# EAGLE design shield 3 (EAGLE 5.06)
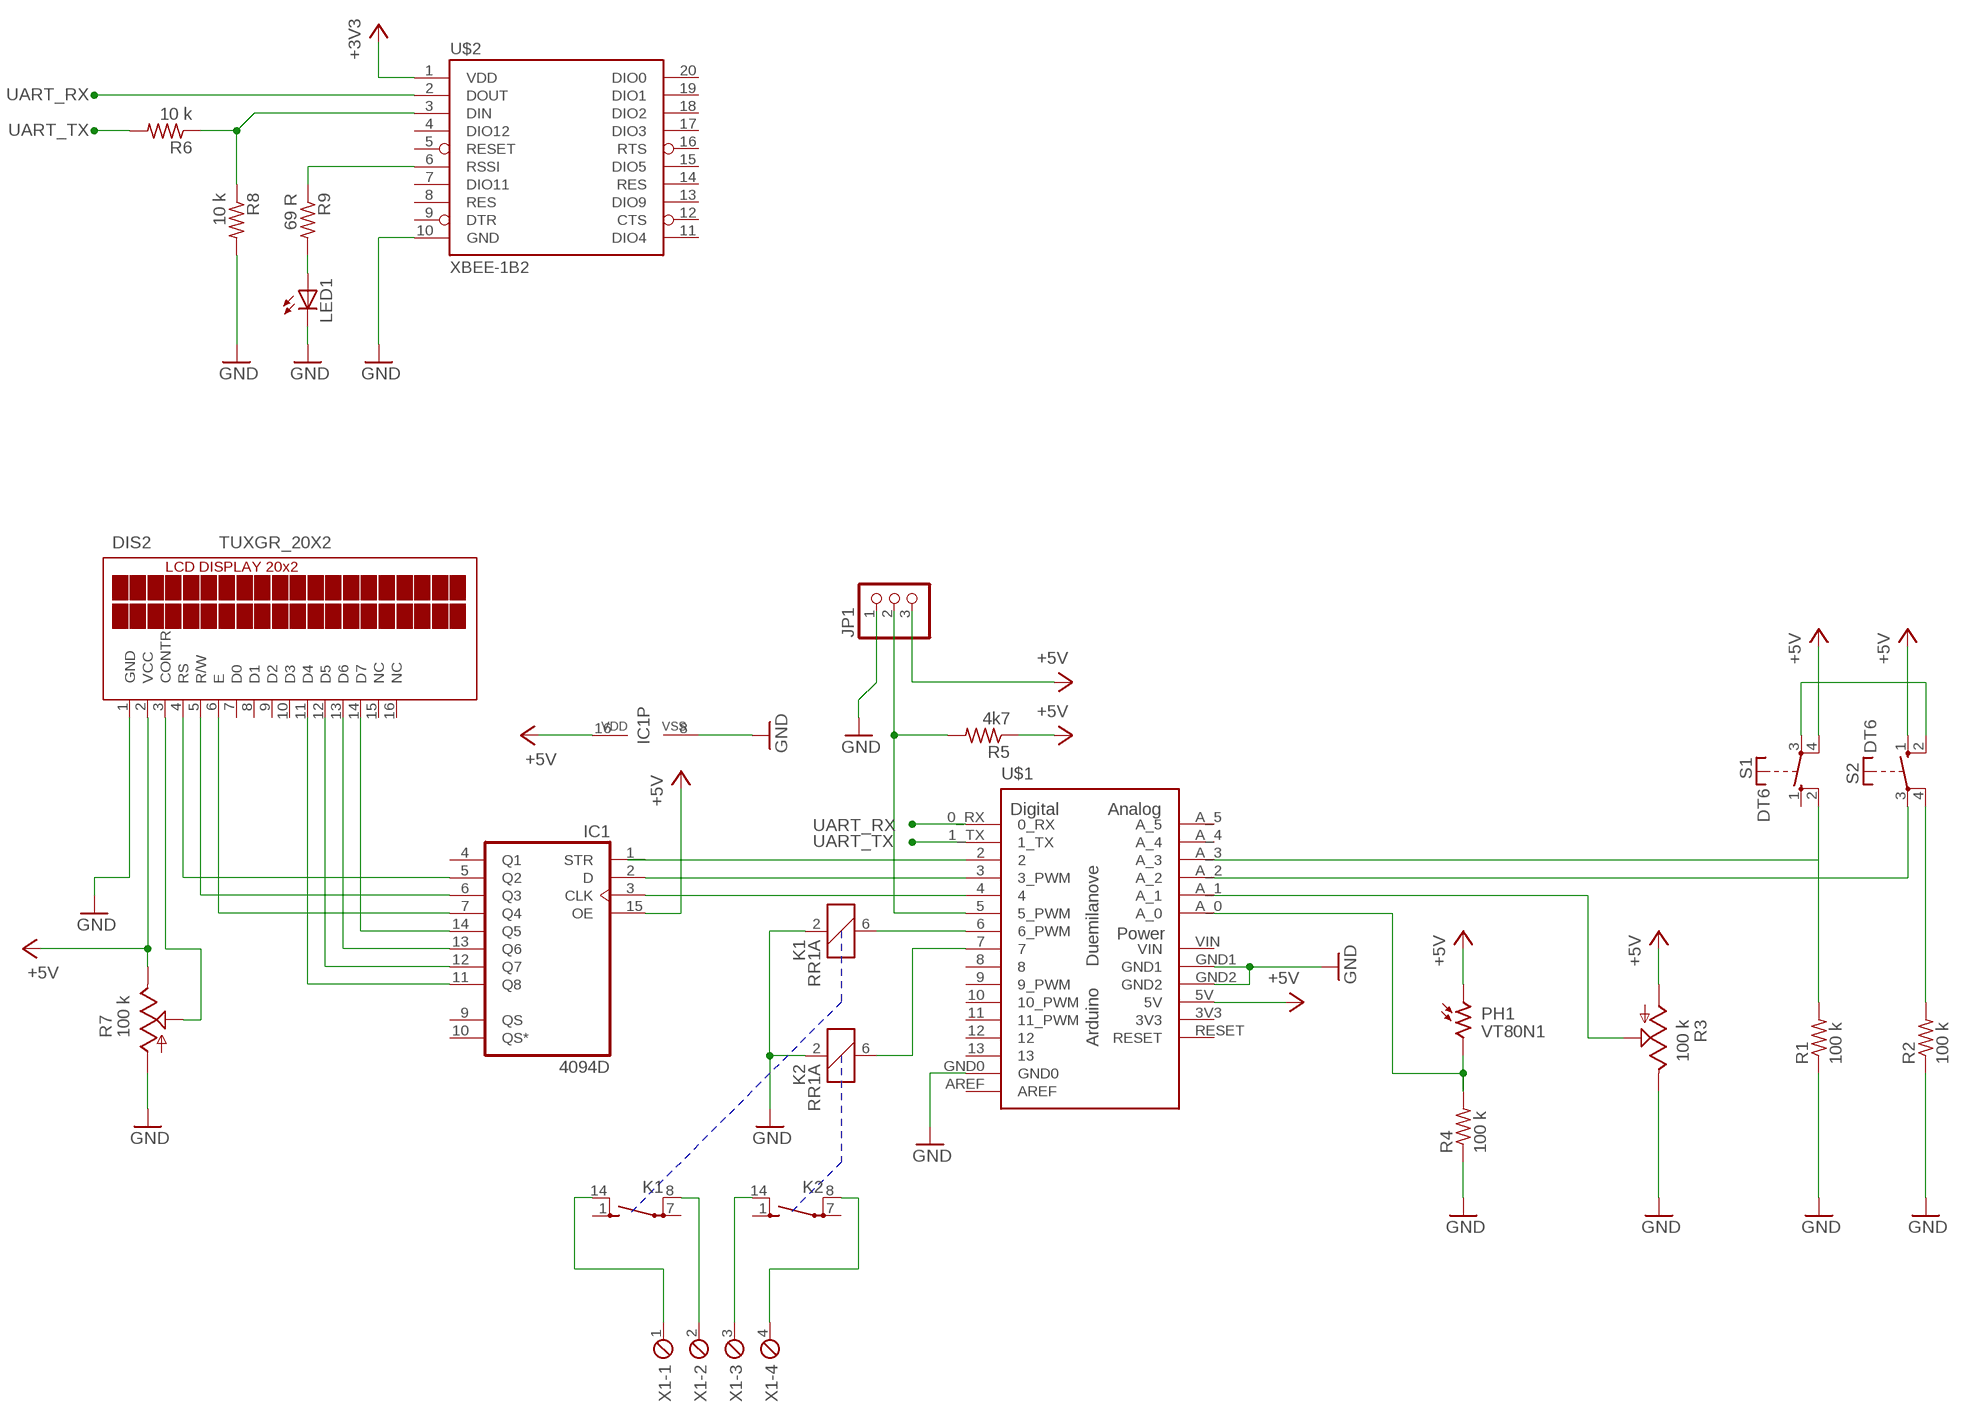
[diagram p0: schematic, sheet 1]

## Parts
DIS2  TUXGR_20X2  [TUXGR_20X2]
IC1  4094D  [SO16]
JP1  PINHD-1X3  [1X03]
K1  RR1A  [RR1A]
K2  RR1A  [RR1A]
LED1  LED3MM  [LED3MM]
PH1  VT80N1  [VT800]
R1  100 k  R-US_R0805  [R0805]
R2  100 k  R-US_R0805  [R0805]
R3  100 k  TRIM_US-B25V  [B25V]
R4  100 k  R-US_R0805  [R0805]
R5  4k7  R-US_R0805  [R0805]
R6  10 k  R-US_R0805  [R0805]
R7  100 k  TRIM_US-S64W  [S64W]
R8  10 k  R-US_R0805  [R0805]
R9  69 R  R-US_R0805  [R0805]
S1  DT6  [DT6]
S2  DT6  [DT6]
U$1  ARDUINO-USBLONG_PADS_TEXT  [SHIELD]
U$2  XBEE-1B2  [XBEE-SILK]
X1  MPT4  [4POL254]

## Nets
+3V3: U$2.1(VDD)
+5V: DIS2.2(VCC) IC1.15(OE) IC1.16(VDD) JP1.3 PH1.1 R3.A R5.1 R7.E S1.4(P) S2.1(S) U$1.5V
GND: DIS2.1(GND) IC1.8(VSS) JP1.1 K1.2 K2.2 LED1.K(C) R1.1 R2.1 R3.E R4.1 R7.A R8.2 U$1.GND0 U$1.GND1 U$1.GND2 U$2.10(GND)
N$1: IC1.1(STR) U$1.2
N$2: IC1.3(CLK) U$1.4
N$3: IC1.2(D) U$1.3(3_PWM)
N$4: K1.6 U$1.6(6_PWM)
N$5: K2.6 U$1.7
N$6: K1.14(2:S) X1.1
N$7: K1.8(2:P) X1.2
N$9: K2.8(2:P) X1.4
N$10: R1.2 S1.2(S) U$1.A_3
N$11: R3.S U$1.A_1
N$12: S2.3(P) U$1.A_2
N$13: PH1.2 R4.2 U$1.A_0
N$14: DIS2.11(D4) IC1.11(Q8)
N$15: DIS2.12(D5) IC1.12(Q7)
N$16: DIS2.13(D6) IC1.13(Q6)
N$17: DIS2.14(D7) IC1.14(Q5)
N$18: DIS2.4(RS) IC1.5(Q2)
N$19: DIS2.5(R/W) IC1.6(Q3)
N$20: DIS2.6(E) IC1.7(Q4)
N$21: DIS2.3(CONTR) R7.S
N$22: JP1.2 R5.2 U$1.5(5_PWM)
N$23: R9.1 U$2.6(RSSI)
N$24: LED1.A R9.2
N$25: R2.2 S2.4(P)
N$26: R6.1 R8.1 U$2.3(DIN)
N$27: S1.3(P) S2.2(S)
N$30: K2.14(2:S) X1.3
UART_RX: U$1.0_RX U$2.2(DOUT)
UART_TX: R6.2 U$1.1_TX
Unconnected: DIS2.7(D0) DIS2.8(D1) DIS2.9(D2) DIS2.10(D3) DIS2.15(NC) DIS2.16(NC) IC1.4(Q1) IC1.9(QS) IC1.10(QS*) K1.1(2:S) K1.7(2:P) K2.1(2:S) K2.7(2:P) S1.1(S) U$1.8 U$1.9(9_PWM) U$1.10(10_PWM) U$1.11(11_PWM) U$1.12 U$1.13 U$1.A_4 U$1.A_5 U$1.AREF U$1.RESET U$2.4(DIO12) U$2.5(RESET) U$2.7(DIO11) U$2.8(RES) U$2.9(DTR) U$2.11(DIO4) U$2.12(CTS) U$2.13(DIO9) U$2.14(RES) U$2.15(DIO5) U$2.16(RTS) U$2.17(DIO3) U$2.18(DIO2) U$2.19(DIO1) U$2.20(DIO0)

## Buses
B$1
B$2

## Power pins joined to a net without a drawn wire
3V3: U$1.3V3
VIN: U$1.VIN

## Library data of the parts
DIS2 = display-lcd:TUXGR_20X2: Tuxgraphics LCD display 20x2 characters reflective, without background light Source: tuxgr_20x2.pdf
IC1 = 40xx:4094: 8-stage SHIFT/STORE REGISTER, tri-state
JP1 = pinhead:PINHD-1X3: PIN HEADER
K1 K2 = relay:RR1A: RELAY reed, polarity, 1 x norm. open with shield
LED1 = led:LED: LED OSRAM: - CHIPLED LG R971, LG N971, LY N971, LG Q971, LY Q971, LO R971, LY R971 LH N974, LH R974 LS Q976, LO Q976, LY Q976 LO Q996 - Hyper CHIPLED LW Q18S LB Q993, LB Q99A, LB R99A - SideLED LS A670, LO A670, LY A670, LG A670, LP A670 LB A673, LV A673, LT A673, LW A673 LH A674 LY A675 LS A676, LA A676, LO A676, LY A676, LW A676 LS A679, LY A679, LG A679 - Hyper Micro SIDELED® LS Y876, LA Y876, LO Y876, LY Y876 LT Y87S - SmartLED LW L88C, LW L88S LB L89C, LB L89S, LG L890 LS L89K, LO L89K, LY L89K LS L896, LA L896, LO L896, LY L896 - TOPLED LS T670, LO T670, LY T670, LG T670, LP T670 LSG T670, LSP T670, LSY T670, LOP T670, LYG T670 LG T671, LOG T671, LSG T671 LB T673, LV T673, LT T673, LW T673 LH T674 LS T676, LA T676, LO T676, LY T676, LB T676, LH T676, LSB T676, LW T676 LB T67C, LV T67C, LT T67C, LS T67K, LO T67K, LY T67K, LW E67C LS E67B, LA E67B, LO E67B, LY E67B, LB E67C, LV E67C, LT E67C LW T67C LS T679, LY T679, LG T679 LS T770, LO T770, LY T770, LG T770, LP T770 LB T773, LV T773, LT T773, LW T773 LH T774 LS E675, LA E675, LY E675, LS T675 LS T776, LA T776, LO T776, LY T776, LB T776 LHGB T686 LT T68C, LB T68C - Hyper Mini TOPLED® LB M676 - Mini TOPLED Santana® LG M470 LS M47K, LO M47K, LY M47K Source: http://www.osram.convergy.de LUXEON: - LUMILED® LXK2-PW12-R00, LXK2-PW12-S00, LXK2-PW14-U00, LXK2-PW14-V00 LXK2-PM12-R00, LXK2-PM12-S00, LXK2-PM14-U00 LXK2-PE12-Q00, LXK2-PE12-R00, LXK2-PE12-S00, LXK2-PE14-T00, LXK2-PE14-U00 LXK2-PB12-K00, LXK2-PB12-L00, LXK2-PB12-M00, LXK2-PB14-N00, LXK2-PB14-P00, LXK2-PB14-Q00 LXK2-PR12-L00, LXK2-PR12-M00, LXK2-PR14-Q00, LXK2-PR14-R00 LXK2-PD12-Q00, LXK2-PD12-R00, LXK2-PD12-S00 LXK2-PH12-R00, LXK2-PH12-S00 LXK2-PL12-P00, LXK2-PL12-Q00, LXK2-PL12-R00 Source: www.luxeon.com KINGBRIGHT: KA-3528ASYC Source: www.kingbright.com
PH1 = photo-elements:VT8: Photoconductive Cell VT800 Series Source: http://optoelectronics.perkinelmer.com/content/Datasheets/DTS_vt800seriesdatasheet.pdf
R1 R2 R4-R6 R8 R9 = rcl:R-US_: RESISTOR, American symbol
R3 R7 = pot:TRIM_US-: POTENTIOMETER
S1 S2 = switch-misc:DT: ITT SWITCH
U$1 = Arduino-Various:ARDUINO-USB: The Ardiuno Duemilanove Pinouts layoutet as a Bare Shield. v0.5 Also for Arduino Diecimila. This is designed as a Part and has no Outline in the Dimension Layer. The Outline, when present, is drawed at the tPlace / bPlace Layer. Library by Stephanie Lange, http://www.k-ita.de/~sl/
U$2 = SparkFun:XBEE-1
X1 = con-phoenix-254:MPT4: PHOENIX CONNECTOR

## Board
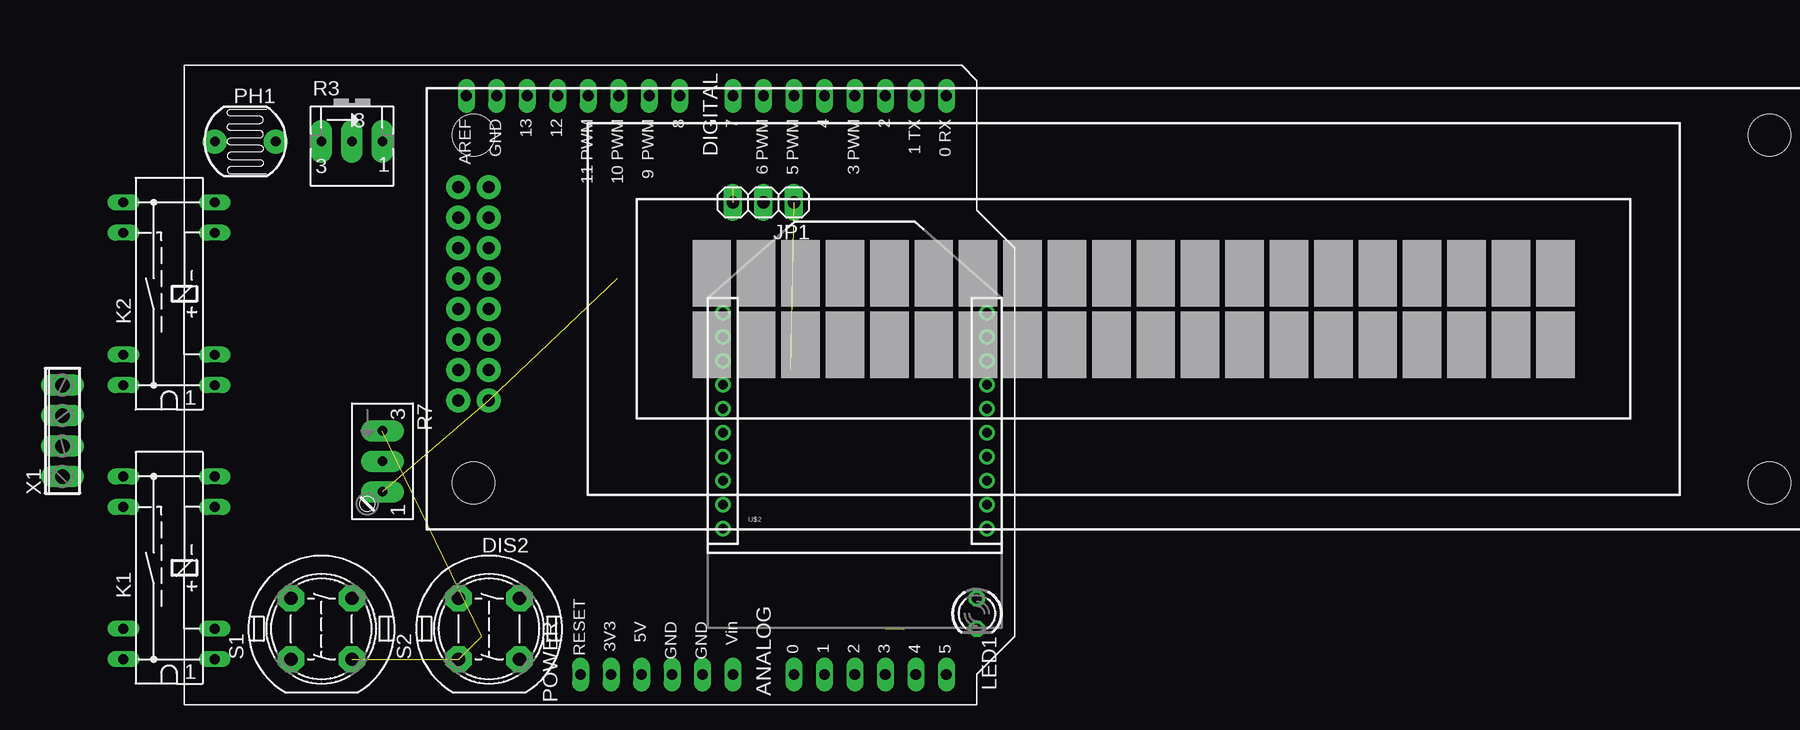
[diagram p1: board, top side]
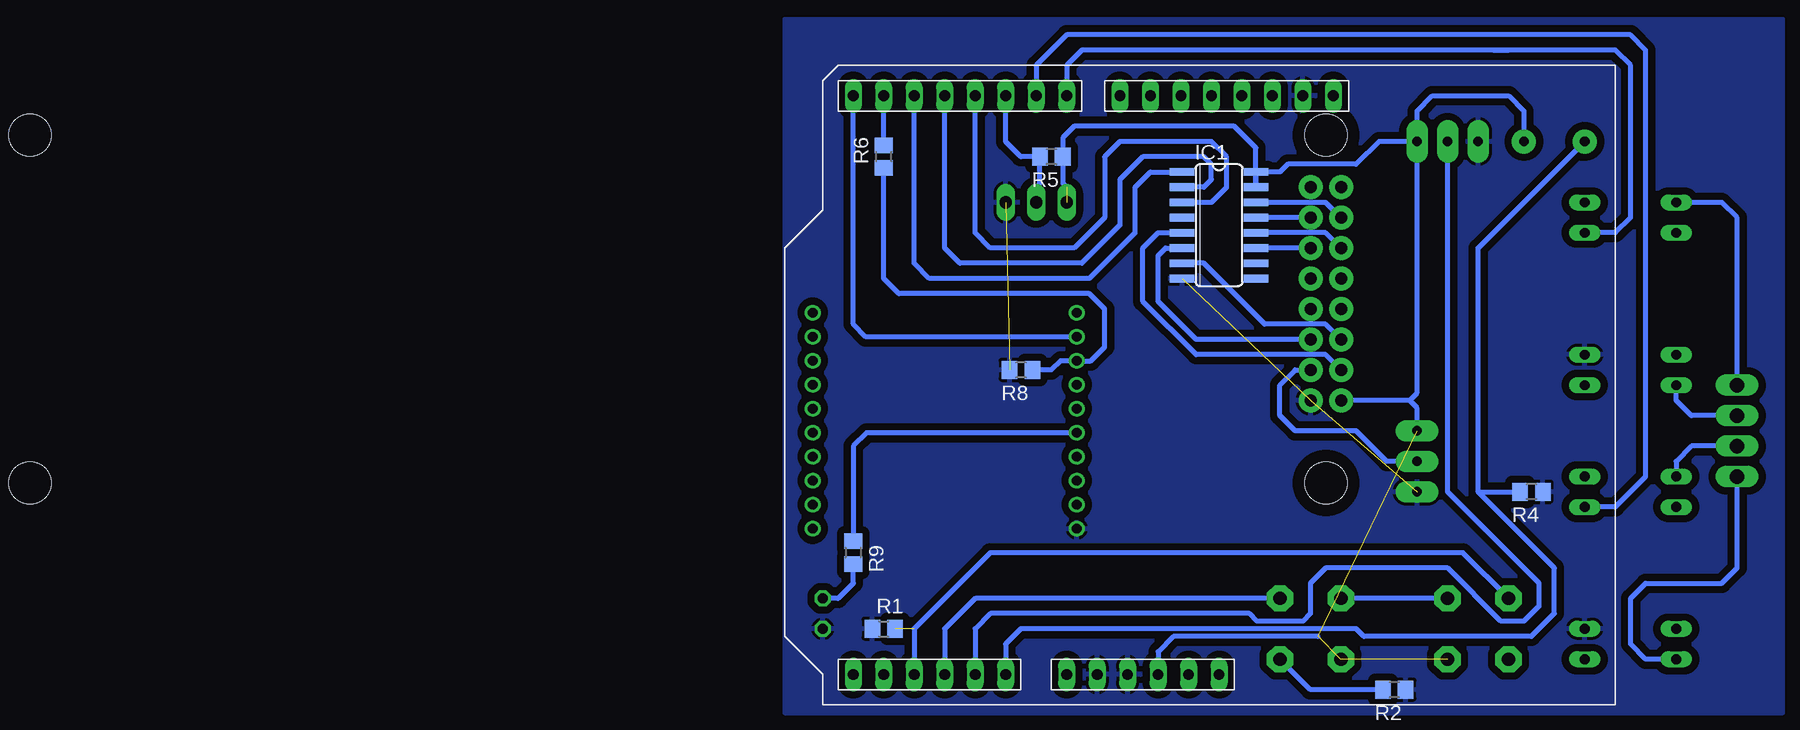
[diagram p2: board, bottom side, seen from below]

No outline drawn. Coordinates in mm, seen from the top.
Copper layers (1*16): Top 0.035mm / dielectric 1.5mm / Bottom 0.035mm
Design rules "default": minimum track width 10mil, minimum drill 24mil, track to track 8mil, track to pad 8mil, pad to pad 8mil, via to via 8mil, smd to smd 8mil, copper to edge 40mil, drill to drill 8mil, minimum pad ring 10mil, minimum via ring 8mil, stop-mask expansion 4mil, vias tented up to drill 0mil, thermal gap 10mil

### Footprints (pad centres in the part's own frame; a part is rotated, then mirrored left to right if it is on the bottom)
TUXGR_20X2 = drill 1 pad 2 round: 1 -52.73,-7.62; 2 -55.27,-7.62; 3 -52.73,-5.08; 4 -55.27,-5.08; 5 -52.73,-2.54; 6 -55.27,-2.54; 7 -52.73,0; 8 -55.27,0; 9 -52.73,2.54; 10 -55.27,2.54; 11 -52.73,5.08; 12 -55.27,5.08; 13 -52.73,7.62; 14 -55.27,7.62; 15 -52.73,10.16; 16 -55.27,10.16 | hole 3.5: -54,-14.5; 54,-14.5; -54,14.5; 54,14.5
SO16 = smd 0.66 x 2.032: 1 -4.445,-3.073; 2 -3.175,-3.073; 3 -1.905,-3.073; 4 -0.635,-3.073; 5 0.635,-3.073; 6 1.905,-3.073; 7 3.175,-3.073; 8 4.445,-3.073; 9 4.445,3.073; 10 3.175,3.073; 11 1.905,3.073; 12 0.635,3.073; 13 -0.635,3.073; 14 -1.905,3.073; 15 -3.175,3.073; 16 -4.445,3.073
1X03 = drill 1.016 long: 1 -2.54,0; 2 0,0; 3 2.54,0
RR1A = drill 0.813 long: 1 -7.62,-3.81; 2 -5.08,-3.81; 6 5.08,-3.81; 7 7.62,-3.81; 8 7.62,3.81; 9 5.08,3.81; 13 -5.08,3.81; 14 -7.62,3.81
LED3MM = drill 0.813 octagon: A -1.27,0; K 1.27,0
VT800 = drill 0.8 pad 2 round: 1 -2.54,0; 2 2.54,0
R0805 = smd 1.3 x 1.5: 1 -0.95,0; 2 0.95,0
B25V = drill 0.8 pad 1.8 long: A 2.54,0.635; E -2.54,0.635; S 0,0.635
S64W = drill 0.8 pad 1.8 long: A 2.54,1.27; E -2.54,1.27; S 0,1.27
DT6 = drill 1.118 pad 2.2 octagon: 1 -2.54,2.54; 2 2.54,2.54; 3 2.54,-2.54; 4 -2.54,-2.54
SHIELD = drill 0.9 pad 1.27 long: 0_RX -25.4,27.94; 1_TX -25.4,25.4; 2 -25.4,22.86; 3 -25.4,20.32; 3V3 22.86,0; 4 -25.4,17.78; 5 -25.4,15.24; 5V 22.86,2.54; 6 -25.4,12.7; 7 -25.4,10.16; 8 -25.4,5.715; 9 -25.4,3.175; 10 -25.4,0.635; 11 -25.4,-1.905; 12 -25.4,-4.445; 13 -25.4,-6.985; A_0 22.86,15.24; A_1 22.86,17.78; A_2 22.86,20.32; A_3 22.86,22.86; A_4 22.86,25.4; A_5 22.86,27.94; AREF -25.4,-12.065; GND0 -25.4,-9.525; GND1 22.86,7.62; GND2 22.86,5.08; RESET 22.86,-2.54; VIN 22.86,10.16
XBEE-SILK = drill 0.8 round: 1 -11,20; 2 -11,18; 3 -11,16; 4 -11,14; 5 -11,12; 6 -11,10; 7 -11,8; 8 -11,6; 9 -11,4; 10 -11,2; 11 11,2; 12 11,4; 13 11,6; 14 11,8; 15 11,10; 16 11,12; 17 11,14; 18 11,16; 19 11,18; 20 11,20
4POL254 = drill 1.2 long: 1 -3.81,0; 2 -1.27,0; 3 1.27,0; 4 3.81,0

### Placement (x,y rotation side)
DIS2  106.05,36.83 0 top
IC1  60.96,43.81 270 bottom
JP1  76.2,45.72 180 top
K1  26.67,15.24 90 top
K2  26.67,38.1 90 top
LED1  93.98,11.43 270 top
PH1  33.02,50.8 180 top
R1  88.9,10.16 0 bottom
R2  46.35,5.08 180 bottom
R3  41.91,50.16 0 top
R4  34.92,21.59 180 bottom
R5  74.93,49.53 180 bottom
R6  88.9,49.53 90 bottom
R7  43.18,24.13 270 top
R8  77.47,31.75 180 bottom
R9  91.44,16.51 270 bottom
S1  39.37,10.16 90 top
S2  53.34,10.16 90 top
U$1  63.5,29.21 270 top
U$2  83.82,16.51 0 top
X1  17.78,26.67 90 top

### Tracks (layer width: path | path; a pad name or v marks a point on that pad's centre or on a via)
+5V  (4 unrouted)
  Bottom 0.406: 52.7,9.53 64.77,9.53 66.04,8.26 U$1.5V | 73.66,46.99 73.98,47.31 R5.1 73.98,51.12 73.03,52.07 59.69,52.07 57.89,50.27 IC1.15 IC1.16 55.88,48.26 55.24,48.9 49.53,48.9 47.62,50.8 R3.A | R7.E 44.45,28.57 45.09,29.21 | R3.A 44.45,29.84 45.09,29.21 | 45.09,29.21 DIS2.2 | R3.A 44.45,53.34 43.18,54.61 36.83,54.61 35.56,53.34 PH1.1
GND  (3 unrouted)
  pour Bottom (isolate 0.61): 13.97,60.96 97.16,60.96 97.16,3.17 13.97,3.17
N$1
  Bottom 0.406: IC1.1 66.67,48.26 67.94,46.99 67.94,43.18 71.75,39.37 85.09,39.37 86.36,40.64 U$1.2
N$2
  Bottom 0.406: U$1.4 81.28,43.18 80.01,41.91 73.03,41.91 70.48,44.45 70.48,49.53 69.22,50.8 61.59,50.8 60.33,49.53 60.33,46.99 61.59,45.72 IC1.3
N$3
  Bottom 0.406: IC1.2 62.23,46.99 61.59,47.62 61.59,48.9 62.23,49.53 67.31,49.53 69.22,47.62 69.22,43.81 72.39,40.64 82.55,40.64 83.82,41.91 U$1.3
N$4
  Bottom 0.406: U$1.6 76.2,57.15 73.66,59.69 26.67,59.69 25.4,58.42 25.4,22.86 27.94,20.32 K1.6
N$5
  Bottom 0.406: U$1.7 73.66,57.15 72.39,58.42 38.1,58.42 | 38.1,58.42 36.83,58.42 | K2.6 27.94,43.18 26.67,44.45 26.67,57.15 27.94,58.42 38.1,58.42
N$6
  Bottom 0.406: X1.1 17.78,15.24 19.05,13.97 25.4,13.97 26.67,12.7 26.67,8.89 25.4,7.62 K1.14
N$7
  Bottom 0.406: X1.2 21.59,25.4 22.86,24.13 K1.8
N$9
  Bottom 0.406: K2.8 19.05,45.72 17.78,44.45 X1.4
N$10  (1 unrouted)
  Bottom 0.406: U$1.A_3 86.36,10.16 80.01,16.51 40.64,16.51 S1.2
N$11
  Bottom 0.406: U$1.A_1 81.28,10.16 80.01,11.43 58.42,11.43 57.78,10.79 53.98,10.79 53.34,11.43 53.34,13.97 52.07,15.24 41.91,15.24 37.47,10.79 35.56,10.79 34.29,12.06 34.29,13.97 41.91,21.59 R3.S
N$12
  Bottom 0.406: U$1.A_2 83.82,10.16 81.28,12.7 S2.3
N$13
  Bottom 0.406: U$1.A_0 78.74,8.89 77.47,10.16 49.53,10.16 48.9,9.53 34.92,9.53 33.02,11.43 33.02,15.24 39.37,21.59 | 39.37,21.59 R4.2 | PH1.2 39.37,41.91 39.37,21.59
N$14
  Bottom 0.406: DIS2.11 IC1.11
N$15
  Bottom 0.406: DIS2.12 50.8,41.91 52.07,43.18 IC1.12
N$16
  Bottom 0.406: DIS2.13 IC1.13
N$17
  Bottom 0.406: DIS2.14 50.8,44.45 52.07,45.72 IC1.14
N$18
  Bottom 0.406: IC1.5 66.04,43.18 67.31,41.91 67.31,37.47 62.87,33.02 52.07,33.02 50.8,31.75 DIS2.4
N$19
  Bottom 0.406: DIS2.5 62.87,34.29 66.04,37.47 66.04,41.27 65.41,41.91 IC1.6
N$20
  Bottom 0.406: IC1.7 62.23,40.64 57.15,35.56 52.07,35.56 50.8,34.29 DIS2.6
N$21
  Bottom 0.406: DIS2.3 54.61,31.75 55.88,30.48 55.88,27.94 54.61,26.67 49.53,26.67 46.99,24.13 R7.S
N$22
  Bottom 0.406: JP1.2 76.2,46.99 75.88,47.31 R5.2 77.47,49.53 78.74,50.8 U$1.5
N$23
  Bottom 0.406: U$2.6 90.33,26.51 91.44,25.4 R9.1
N$24
  Bottom 0.406: LED1.A 92.71,12.7 91.44,13.97 R9.2
N$25
  Bottom 0.406: R2.2 53.34,5.08 S2.4
N$26
  Bottom 0.406: R6.1 88.9,39.37 87.63,38.1 71.75,38.1 70.48,36.83 70.48,33.66 71.63,32.51 U$2.3 74.17,32.51 74.93,31.75 R8.1
N$27
  Bottom 0.406: S1.3 S2.2
N$30
  Bottom 0.406: X1.3 21.59,27.94 22.86,29.21 K2.14
UART_RX
  Bottom 0.406: U$2.2 90.39,34.51 91.44,35.56 U$1.0_RX
UART_TX
  Bottom 0.406: R6.2 U$1.1_TX